# Altium project NB2DSK-SPK.PRJPCB
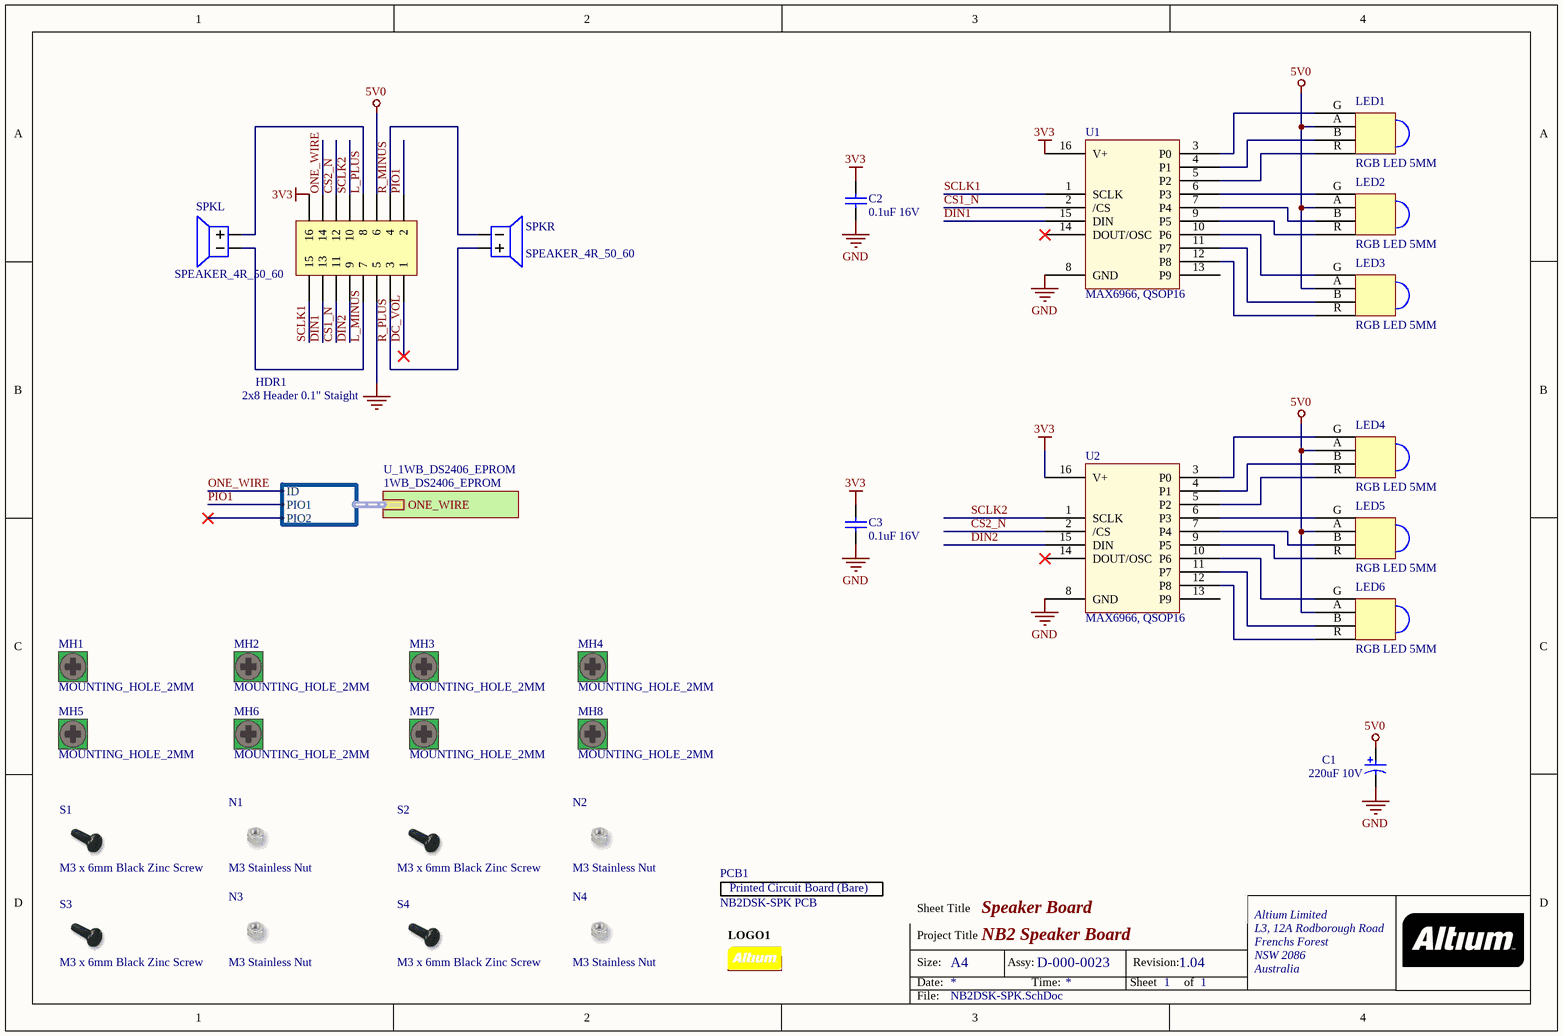
[diagram p0: NB2DSK-SPK.SchDoc]
ProjectAddress1: L3, 12A Rodborough Road; ProjectAddress2: Frenchs Forest; ProjectAddress3: NSW 2086; ProjectAddress4: Australia; ProjectAssyNum: D-000-0023; ProjectOrganization: Altium Limited; ProjectRevision: 1.04; ProjectTitle: NB2 Speaker Board; ProjectTotalSheets: 1
1 sheet, 32 parts. Net scope: hierarchical (ports join the sheet entries above them; power ports are global).
Board file: NB2DSK-SPK.PcbDoc

## Sheet NB2DSK-SPK.SchDoc: Speaker Board
size A4; SheetNumber: 1; SheetTotal: 1; PageSetup: Record=PageOptions|CenterHorizontal=True|CenterVertical=True|PrintScale=0.97|XCorrection=1.00|YCorrection=1.00|PrintKind=1|BorderSize=5000000|LeftOffset=0|BottomOffset=0|Orientation=2|PaperLength=1000|PaperWidth=1000|Scale=100|PaperSource=7|PrintQuality=-4|MediaType=1|DitherType=10|PaperKind=A4 (210 x 297 mm)|PrintScaleMode=1

### Parts
C1  220uF 10V  [CAPC7343-STAR]
C2  0.1uF 16V  [CAPC1005-STAR]
C3  0.1uF 16V  [CAPC1005-STAR]
HDR1  2x8 Header 0.1" Staight  [HDR2X8]
LED1  RGB LED 5MM  [LED-RGB-5MM-RA]
LED2  RGB LED 5MM  [LED-RGB-5MM-RA]
LED3  RGB LED 5MM  [LED-RGB-5MM-RA]
LED4  RGB LED 5MM  [LED-RGB-5MM-RA]
LED5  RGB LED 5MM  [LED-RGB-5MM-RA]
LED6  RGB LED 5MM  [LED-RGB-5MM-RA]
LOGO1  Altium  [Logo-Altium]  (value not drawn)  (no BOM)
MH1  MOUNTING_HOLE_2MM  [MOUNTING_HOLE_2MM]  (no BOM)
MH2  MOUNTING_HOLE_2MM  [MOUNTING_HOLE_2MM]  (no BOM)
MH3  MOUNTING_HOLE_2MM  [MOUNTING_HOLE_2MM]  (no BOM)
MH4  MOUNTING_HOLE_2MM  [MOUNTING_HOLE_2MM]  (no BOM)
MH5  MOUNTING_HOLE_2MM  [MOUNTING_HOLE_2MM]  (no BOM)
MH6  MOUNTING_HOLE_2MM  [MOUNTING_HOLE_2MM]  (no BOM)
MH7  MOUNTING_HOLE_2MM  [MOUNTING_HOLE_2MM]  (no BOM)
MH8  MOUNTING_HOLE_2MM  [MOUNTING_HOLE_2MM]  (no BOM)
N1  M3 Stainless Nut  (mechanical)
N2  M3 Stainless Nut  (mechanical)
N3  M3 Stainless Nut  (mechanical)
N4  M3 Stainless Nut  (mechanical)
PCB1  NB2DSK-SPK PCB  (mechanical)
S1  M3 x 6mm Black Zinc Screw  (mechanical)
S2  M3 x 6mm Black Zinc Screw  (mechanical)
S3  M3 x 6mm Black Zinc Screw  (mechanical)
S4  M3 x 6mm Black Zinc Screw  (mechanical)
SPKL  SPEAKER_4R_50_60  [SPEAKER_4R_50_60]
SPKR  SPEAKER_4R_50_60  [SPEAKER_4R_50_60]
U1  MAX6966, QSOP16  [QSOP16]
U2  MAX6966, QSOP16  [QSOP16]

### Sub-sheets
U_1WB_DS2406_EPROM = 1WB_DS2406_EPROM (file not in this document): ONE_WIRE (harness ONE_WIRE)

### Harnesses
ONE_WIRE: ID, PIO2, PIO1

### Nets
3V3: C2.2 C3.2 HDR1.16 U1.16(V+) U2.16(V+)
5V0: C1.1 HDR1.6 LED1.A LED2.A LED3.A LED4.A LED5.A LED6.A
GND: C1.2 C2.1 C3.1 HDR1.5 U1.8(GND) U2.8(GND)
CS1_N: HDR1.11 U1.2(/CS)
CS2_N: HDR1.12 U2.2(/CS)
DC_VOL: HDR1.1
DIN1: HDR1.13 U1.15(DIN)
DIN2: HDR1.9 U2.15(DIN)
L_MINUS: HDR1.7 SPKL.2
L_PLUS: HDR1.8 SPKL.1
ONE_WIRE: HDR1.14 ; sheet U_1WB_DS2406_EPROM/ONE_WIRE.ID
PIO1: HDR1.2 ; sheet U_1WB_DS2406_EPROM/ONE_WIRE.PIO1
R_MINUS: HDR1.4 SPKR.2
R_PLUS: HDR1.3 SPKR.1
SCLK1: HDR1.15 U1.1(SCLK)
SCLK2: HDR1.10 U2.1(SCLK)
NetLED1_B: LED1.B U1.4(P1)
NetLED1_G: LED1.G U1.3(P0)
NetLED1_R: LED1.R U1.5(P2)
NetLED2_B: LED2.B U1.7(P4)
NetLED2_G: LED2.G U1.6(P3)
NetLED2_R: LED2.R U1.9(P5)
NetLED3_B: LED3.B U1.11(P7)
NetLED3_G: LED3.G U1.10(P6)
NetLED3_R: LED3.R U1.12(P8)
NetLED4_B: LED4.B U2.4(P1)
NetLED4_G: LED4.G U2.3(P0)
NetLED4_R: LED4.R U2.5(P2)
NetLED5_B: LED5.B U2.7(P4)
NetLED5_G: LED5.G U2.6(P3)
NetLED5_R: LED5.R U2.9(P5)
NetLED6_B: LED6.B U2.11(P7)
NetLED6_G: LED6.G U2.10(P6)
NetLED6_R: LED6.R U2.12(P8)

Not connected (* = marked no-connect by the designer): MH1 1; MH2 1; MH3 1; MH4 1; MH5 1; MH6 1; MH7 1; MH8 1; U1 13(P9) 14(DOUT/OSC)*; U2 13(P9) 14(DOUT/OSC)*

### Notes on the sheet
- Sheet Title
- Project Title
- Size:
- Date:
- A4
- Assy:
- Time:
- Sheet
- Revision:
- of
- File:
- (in symbol D-000-0015) Printed Circuit Board (Bare)

### Library data of the parts
C1 = D-101-0088: Capacitor, Tantalum, 220uF 10% 10V MCCT-D (7343-31); Polarity: Polarized; Capacitance: 220 uF; Mounting Technology: Surface Mount; Rated Voltage: 10 V; Status: Unreleased; Technology: Tantalum; Tolerance: 10 %; Category: Capacitor
C2 C3 = D-101-0080: Capacitor, Ceramic, 0.1uF 10% 16V 0402 (1005) X7R; Polarity: Non-Polarized; Capacitance: 0.1 uF; Dielectric: X7R; Mounting Technology: Surface Mount; Rated Voltage: 16 V; Status: Production; Technology: Ceramic; Tolerance: 10 %; Category: Capacitor
HDR1 = D-300-0041: Header, BOX 2x8, 0.1", Straight, Raised; Max Current: mA; Connector type: Header; Mounting Technology: Through-Hole; Pin Count: 16; Status: Production; Category: Connector
LED1-LED6 = D-153-0001: LED, RGB, 5mm, 540R2GBC-CA, Common Anode; Brightness: 1500 mcd; Peak Wave Length: nm; Color: RGB; Mounting Technology: Through-Hole; Status: Production; Category: LED
LOGO1 = D-000-0003: Altium Logo for PCB; Category: Graphic-PCB; Status: Production
MH1-MH8 = MOUNTING_HOLE_2MM: 2mm Diameter Mounting Hole; Design Item Id: MOUNTING_HOLE_2MM
N1-N4 = D-008-0022: Status: Unreleased; Category: Mechanical
PCB1 = D-000-0015: PCB, NB2 Speaker Board (NB2DSK-SPK); Status: Unreleased; Category: Graphic-PCB
S1-S4 = D-008-0012: M3 Black-Zinc Cross-Recess Pan-Head Machine Screw 6mm long; Status: Unreleased; Category: Mechanical
SPKL SPKR = D-003-0001: Speaker, 4 Omh 3W 50mm Cone 60mm Body; Status: Production; Category: Speaker
U1 U2 = D-243-0001: MAX6966, 10 port Constant Current LED Driver, SPI; Supply Voltage: mV; Mounting Technology: Surface Mount; Status: Production; Category: IC-Other